# EAGLE schematic UPTC (EAGLE 9.5.2)
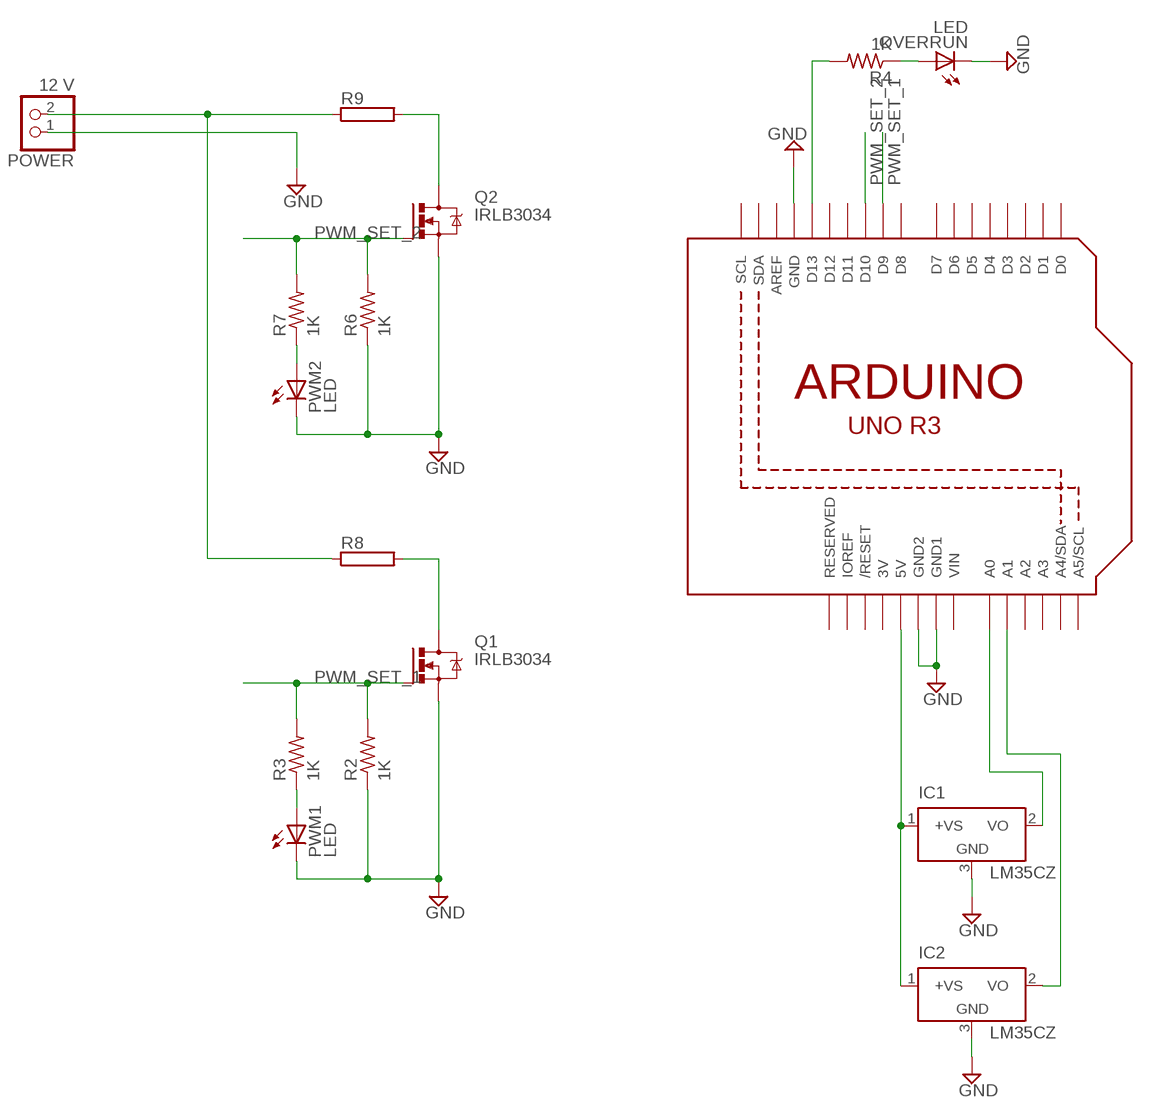
[diagram p0: schematic, sheet 1]

## Parts
IC1  LM35CZ  [TO92]
IC2  LM35CZ  [TO92]
OVERRUN  LED  LED5MM  [LED5MM]
POWER  12 V  PINHD-1X2  [1X02]
PWM1  LED  LED5MM  [LED5MM]
PWM2  LED  LED5MM  [LED5MM]
Q1  IRLB3034  IRF520  [TO220BV]
Q2  IRLB3034  IRF520  [TO220BV]
R2  1K  R-US_0207/10  [0207/10]
R3  1K  R-US_0207/10  [0207/10]
R4  1K  R-US_0207/10  [0207/10]
R6  1K  R-US_0207/10  [0207/10]
R7  1K  R-US_0207/10  [0207/10]
R8  RAC05  [AC05]
R9  RAC05  [AC05]
U2  ARDUINOR3-BPLACE  [ARDUINOR3-BPLACE]

## Nets
GND: IC1.3(GND) IC2.3(GND) OVERRUN.K(C) POWER.1 PWM1.K(C) PWM2.K(C) Q1.S Q2.S R2.1 R6.1 U2.GND U2.GND1 U2.GND2
N$2: Q1.D R8.2
N$4: IC1.2(VO) U2.A0
N$5: R4.2 U2.D13
N$6: PWM1.A R3.1
N$7: OVERRUN.A R4.1
N$8: IC2.2(VO) U2.A1
N$9: Q2.D R9.2
N$10: PWM2.A R7.1
N$11: POWER.2 R8.1 R9.1
PWM_SET_1: Q1.G R2.2 R3.2 U2.D9
PWM_SET_2: Q2.G R6.2 R7.2 U2.D10
VCC: IC1.1(+VS) IC2.1(+VS) U2.5V
Unconnected: U2.A2 U2.A3 U2.A4(A4/SDA) U2.A5(A5/SCL) U2.AREF U2.D0 U2.D1 U2.D2 U2.D3 U2.D4 U2.D5 U2.D6 U2.D7 U2.D8 U2.D11 U2.D12 U2.IOREF U2.RESERVED U2.RESET(/RESET) U2.SCL U2.SDA

## Power pins joined to a net without a drawn wire
3V: U2.3V
VIN: U2.VIN

## Library data of the parts
IC1 IC2 = lm35:LM35: Single-Supply Centigrade Temperature Sensor Vout = (10mV/°C x Temp °C) +5mmmV Source: http://www.national.com/ds/LM/LM35.pdf
OVERRUN PWM1 PWM2 = adafruit:LED: LED OSRAM: - CHIPLED LG R971, LG N971, LY N971, LG Q971, LY Q971, LO R971, LY R971 LH N974, LH R974 LS Q976, LO Q976, LY Q976 LO Q996 - Hyper CHIPLED LW Q18S LB Q993, LB Q99A, LB R99A - SideLED LS A670, LO A670, LY A670, LG A670, LP A670 LB A673, LV A673, LT A673, LW A673 LH A674 LY A675 LS A676, LA A676, LO A676, LY A676, LW A676 LS A679, LY A679, LG A679 - Hyper Micro SIDELED® LS Y876, LA Y876, LO Y876, LY Y876 LT Y87S - SmartLED LW L88C, LW L88S LB L89C, LB L89S, LG L890 LS L89K, LO L89K, LY L89K LS L896, LA L896, LO L896, LY L896 - TOPLED LS T670, LO T670, LY T670, LG T670, LP T670 LSG T670, LSP T670, LSY T670, LOP T670, LYG T670 LG T671, LOG T671, LSG T671 LB T673, LV T673, LT T673, LW T673 LH T674 LS T676, LA T676, LO T676, LY T676, LB T676, LH T676, LSB T676, LW T676 LB T67C, LV T67C, LT T67C, LS T67K, LO T67K, LY T67K, LW E67C LS E67B, LA E67B, LO E67B, LY E67B, LB E67C, LV E67C, LT E67C LW T67C LS T679, LY T679, LG T679 LS T770, LO T770, LY T770, LG T770, LP T770 LB T773, LV T773, LT T773, LW T773 LH T774 LS E675, LA E675, LY E675, LS T675 LS T776, LA T776, LO T776, LY T776, LB T776 LHGB T686 LT T68C, LB T68C - Hyper Mini TOPLED® LB M676 - Mini TOPLED Santana® LG M470 LS M47K, LO M47K, LY M47K Source: http://www.osram.convergy.de/
POWER = pinhead:PINHD-1X2: PIN HEADER
Q1 Q2 = transistor-power:IRF520: HEXFET Power MOSFET
R2-R4 R6 R7 = adafruit:R-US_: RESISTOR, American symbol
R8 R9 = resistor-power:R: Power Resitor; OC_FARNELL: unknown; OC_NEWARK: unknown
U2 = adafruit:ARDUINOR3: This is a new object for the new Arduino R3 - with extra pins that you may want to use (such as IOref, and duplicated A4/A5